# EAGLE design ssd_blinky_eagle (EAGLE 6.5.0)
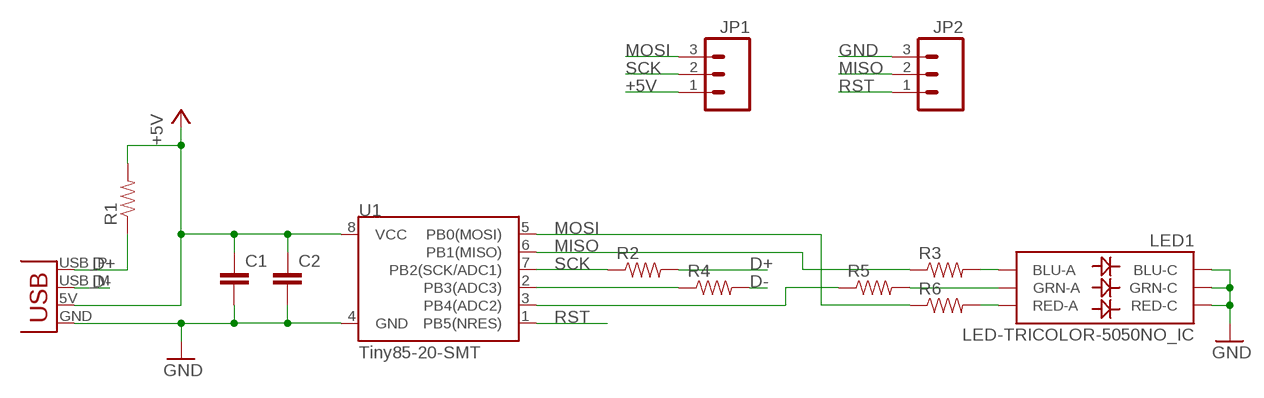
[diagram p0: schematic, sheet 1]

## Parts
C1  CAP1206  [1206]
C2  CAP1206  [1206]
JP1  M03SMD_RA_MALE  [1X03_SMD_RA_MALE]
JP2  M03SMD_RA_MALE  [1X03_SMD_RA_MALE]
JP3  USBPCB  [USB-A-PCB]
LED1  LED-TRICOLOR-5050NO_IC  [LED-TRICOLOR-5050]
R1  RESISTOR1206  [1206]
R2  RESISTOR1206  [1206]
R3  RESISTOR1206  [1206]
R4  RESISTOR1206  [1206]
R5  RESISTOR1206  [1206]
R6  RESISTOR1206  [1206]
U1  Tiny85-20-SMT  ATTINY45TINY85-20-SMT  [SO08-EIAJ]

## Nets
+5V: C1.1 C2.1 JP1.1 JP3.5V(VBUS) R1.2 U1.8(VCC)
D+: JP3.USB_P(D+) R1.1 R2.2
D-: JP3.USB_M(D-) R4.2
GND: C1.2 C2.2 JP2.3 JP3.GND LED1.4(BLU-C) LED1.5(RED-C) LED1.6(GRN-C) U1.4(GND)
MISO: JP2.2 R5.1 U1.3(PB4(ADC2))
MOSI: JP1.3 R6.1 U1.5(PB0(MOSI))
N$1: R4.1 U1.2(PB3(ADC3))
N$2: R3.1 U1.6(PB1(MISO))
N$4: LED1.2(RED-A) R6.2
N$5: LED1.1(GRN-A) R5.2
N$6: LED1.3(BLU-A) R3.2
RST: JP2.1 U1.1(PB5(NRES))
SCK: JP1.2 R2.1 U1.7(PB2(SCK/ADC1))

## Library data of the parts
C1 C2 = SparkFun-Passives:CAP: Capacitor Standard 0603 ceramic capacitor, and 0.1" leaded capacitor.
JP1 JP2 = SparkFun-Connectors:M03: Header 3 Standard 3-pin 0.1" header. Use with straight break away headers (SKU : PRT-00116), right angle break away headers (PRT-00553), swiss pins (PRT-00743), machine pins (PRT-00117), and female headers (PRT-00115). Molex polarized connector foot print use with SKU : PRT-08232 with associated crimp pins and housings.; PROD_ID: CONN-10925
JP3 = SparkFun-Connectors:USB: USB Connectors USB-B-PTH is fully proven SKU : PRT-00139/CONN-08278 USB-miniB is fully proven SKU : PRT-00587 USB-A-PCB is untested. USB-A-H is throughly reviewed, but untested. Spark Fun Electronics SKU : PRT-00437 USB-B-SMT is throughly reviewed, but untested. Needs silkscreen touching up. USB-A-S has not been used/tested USB-MB-H has not been used/tested USB-MICROB has been used. CONN-09505
LED1 = SparkFun-LED:LED-TRICOLOR-5050
R1-R6 = SparkFun-Passives:RESISTOR: Resistor Basic schematic elements and footprints for 0603, 1206, and PTH resistors.
U1 = SparkFun-DigitalIC:ATTINY45: Atmel 8-pin 2/4/8kB flash uC; PROD_ID: IC-09092

## Board
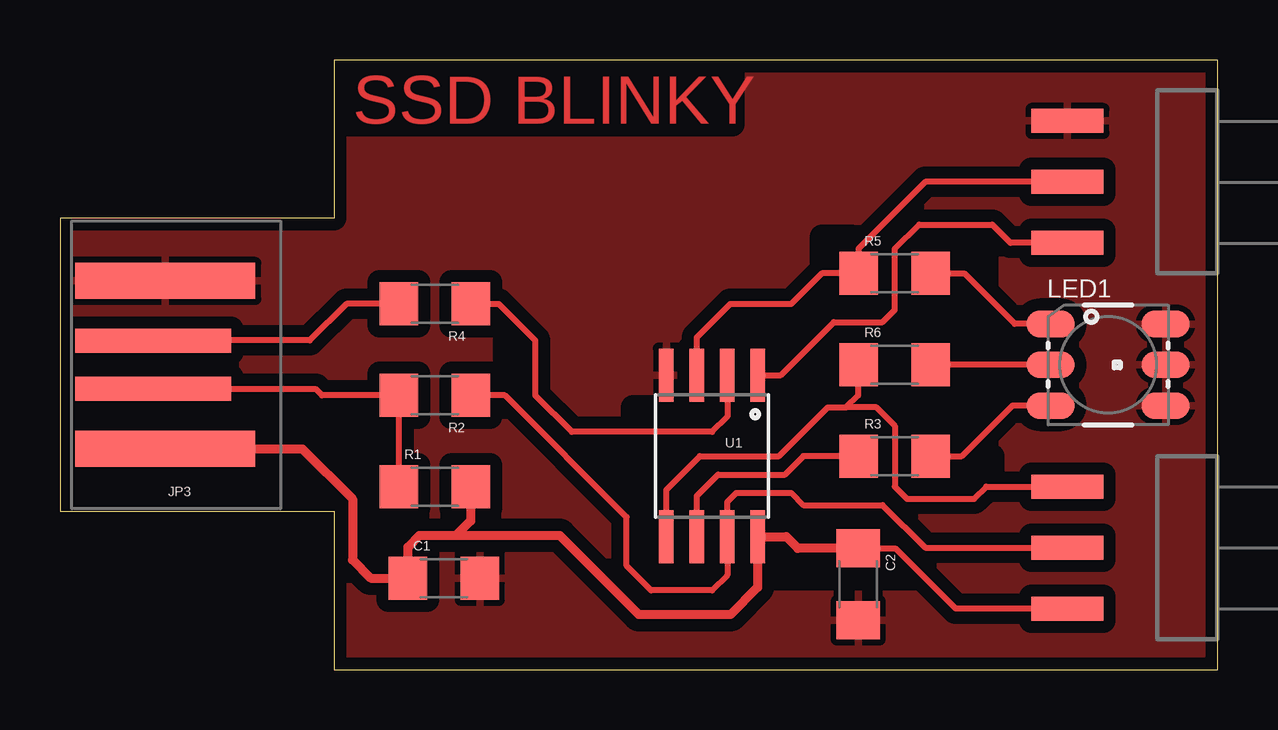
[diagram p1: board, top side]

Size 48.26 x 25.4 mm. Coordinates in mm from the lower left corner, seen from the top.
Outline: 11.43,0 48.26,0 48.26,25.4 11.43,25.4 11.43,18.8 0,18.8 0,6.6 11.43,6.6 11.43,0
Copper layers (1+16): Top 0.0178mm / dielectric 12mil / Bottom 0.0178mm
Design rules "GoldPhoenix-BES-2Lyr *": minimum track width 6mil, minimum drill 8mil, track to track 12mil, track to pad 12mil, pad to pad 12mil, via to via 12mil, smd to smd 12mil, copper to edge 20mil, drill to drill 16mil, minimum pad ring 8mil, minimum via ring 8mil, stop-mask expansion 3mil, vias tented up to drill 0mil, thermal gap 10mil
tRestrict: area 38.1,8.1 to 38.9,8.9; area 23.9,10.4 to 25.4,10.9; area 37.8,17 to 38.6,17.8; area 30,4.1 to 31.8,4.6; area 24.1,7.6 to 24.6,9.4; area 31.8,16.8 to 32,18; area 32,17.8 to 33,18; area 30,3.8 to 35.6,4.1; area 38.4,16.3 to 38.6,17; area 18.5,11.9 to 19,13.7

### Footprints (pad centres in the part's own frame; a part is rotated, then mirrored left to right if it is on the bottom)
1206 = smd 1.6 x 1.8: 1 -1.5,0; 2 1.5,0
1X03_SMD_RA_MALE = smd 1 x 3: 1 -2.54,5; 2 0,5; 3 2.54,5
USB-A-PCB = smd 7.5 x 1.5: 5V -0.2,3.5; GND -0.2,-3.5 | smd 6.5 x 1: USB_M 0.3,-1; USB_P 0.3,1
LED-TRICOLOR-5050 = smd 2 x 1.1: 1 -2.4,1.7; 2 -2.4,0; 3 -2.4,-1.7; 4 2.4,-1.7; 5 2.4,0; 6 2.4,1.7
SO08-EIAJ = smd 0.61 x 2.21: 1 -1.905,-3.378; 2 -0.635,-3.378; 3 0.635,-3.378; 4 1.905,-3.378; 5 1.905,3.353; 6 0.635,3.353; 7 -0.635,3.353; 8 -1.905,3.353

### Placement (x,y rotation side)
C1  16,3.81 0 top
C2  33.27,3.56 270 top
JP1  46.99,5.08 90 top
JP2  46.99,20.32 90 top
JP3  4.19,12.7 180 top
LED1  43.69,12.7 0 top
R1  15.62,7.62 0 top
R2  15.62,11.43 180 top
R3  34.8,8.89 0 top
R4  15.62,15.24 180 top
R5  34.8,16.51 0 top
R6  34.8,12.7 0 top
U1  27.18,8.89 180 top

### Tracks (layer width: path | path; a pad name or v marks a point on that pad's centre or on a via)
+5V
  Top 0.254: 17.14,7.62 17.14,7.6 R1.2 | JP1.1 37.34,2.54 34.82,5.06 C2.1
  Top 0.381: JP3.5V 10.1,9.2 12.19,7.11 12.19,4.57 12.95,3.81 C1.1 14.5,5.1 14.99,5.59 16.51,5.59 | C2.1 30.76,5.06 30.28,5.54 U1.8 29.08,3.43 27.94,2.29 24.13,2.29 20.83,5.59 16.51,5.59 | R1.2 17.12,6.2 16.51,5.59
D+
  Top 0.254: JP3.USB_P 10.65,11.7 10.92,11.43 R2.2 R1.1
D-
  Top 0.254: R4.2 11.94,15.24 10.41,13.72 3.91,13.72 JP3.USB_M
GND
  pour Top (isolate 0.508, rank 6): 0.64,24.77 47.62,24.77 47.62,0.64 0.64,0.64
MISO
  Top 0.254: JP2.2 36.07,20.32 33.3,17.55 R5.1 31.75,16.51 30.48,15.24 27.94,15.24 26.54,13.84 U1.3
MOSI
  Top 0.254: U1.5 25.27,7.49 26.67,8.89 29.97,8.89 32,10.92 32.77,10.92 | JP1.3 38.61,7.62 38.1,7.11 35.31,7.11 34.8,7.62 34.8,10.16 34.04,10.92 32.77,10.92 | 32.77,10.92 33.27,11.43 33.27,12.68 R6.1
N$1
  Top 0.254: U1.2 27.81,10.54 27.18,9.91 21.34,9.91 19.81,11.43 19.81,13.72 18.29,15.24 R4.1
N$2
  Top 0.254: U1.6 26.54,7.24 27.43,8.13 30.23,8.13 30.99,8.89 R3.1
N$4
  Top 0.254: LED1.2 R6.2
N$5
  Top 0.254: LED1.1 39.8,14.4 37.69,16.51 R5.2
N$6
  Top 0.254: LED1.3 39.7,11 37.59,8.89 R3.2
RST
  Top 0.254: 42.93,17.78 JP2.1 39.62,17.78 38.86,18.54 35.81,18.54 34.8,17.53 34.8,14.99 34.29,14.48 32.26,14.48 30.05,12.27 U1.1
SCK
  Top 0.254: R2.1 18.54,11.43 23.62,6.35 23.62,4.32 24.64,3.3 27.18,3.3 27.81,3.94 U1.7 27.81,6.99 28.19,7.37 30.48,7.37 30.99,6.86 34.29,6.86 36.07,5.08 JP1.2

### Text on the board
Top: SSD BLINKY